# EAGLE design RR_PDB (EAGLE 9.6.2)
Power distribution board for the Reading Robot
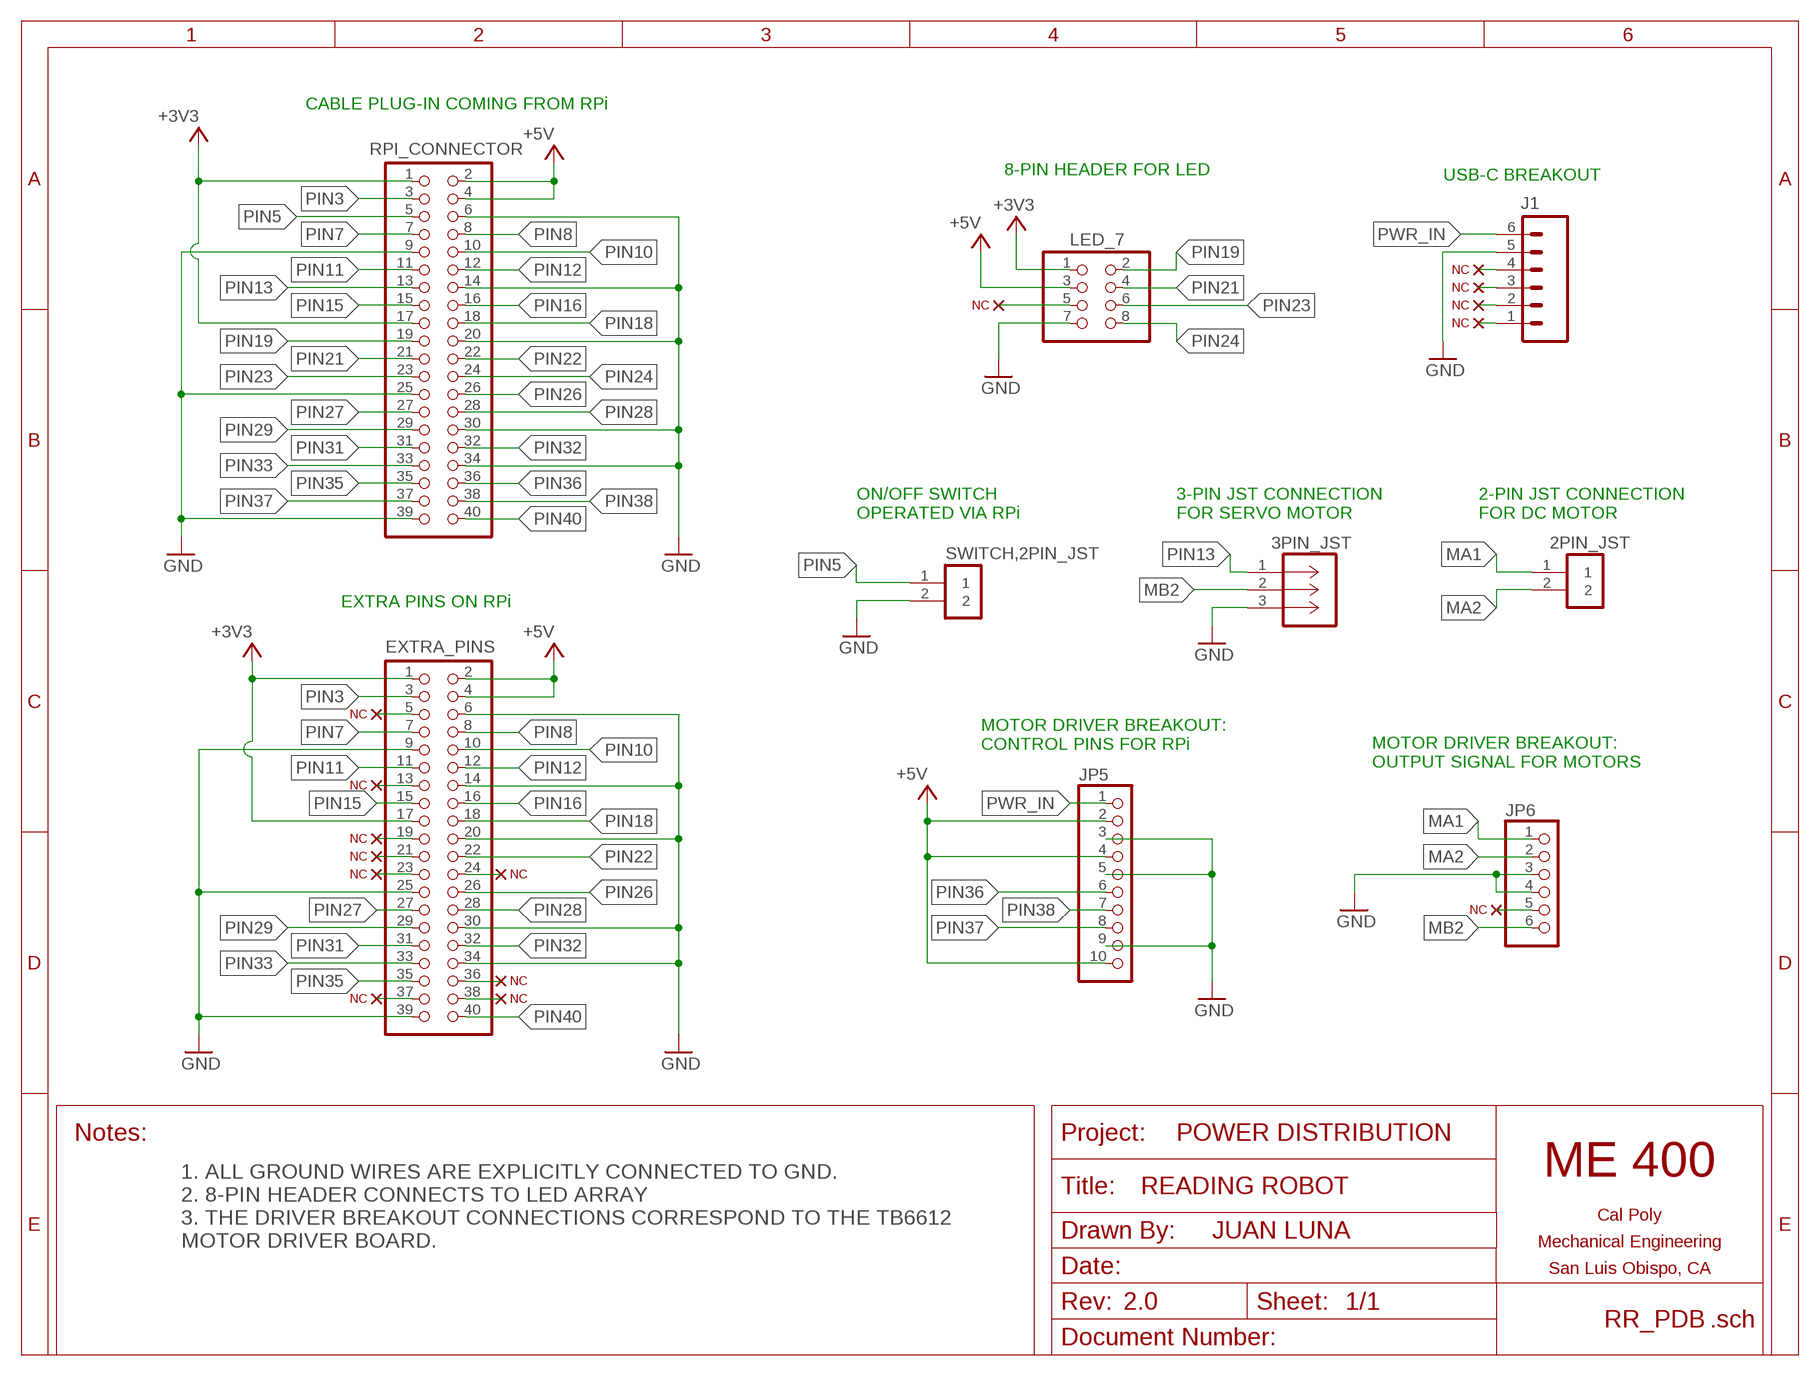
[diagram p0: schematic, sheet 1]
FRAME1 (TITLEBLOCK_LET_L): AUTHOR: JUAN LUNA; BOARD_NAME: READING ROBOT; COURSE: ME 400; DOC_NUM: 1; PROJECT_NAME: POWER DISTRIBUTION; REVISION: 2.0

## Parts
2PIN_JST  B2B-PH-K-S(LF)(SN)  [JST_B2B-PH-K-S(LF)(SN)]
3PIN_JST  B3B-PH-K-S(LF)(SN)  [CONN_B3B-PH-K-S(LF)(SN)_JST]
EXTRA_PINS  PINHD-2X20  [2X20]
J1  CONN_06NO_SILK_NO_POP  [1X06_NO_SILK]
JP5  HEADER-1X10THICKER  [1X10_ROUND_76]
JP6  PINHD-1X6CB  [1X06-CLEANBIG]
LED_7  PINHD-2X4  [2X04]
RPI_CONNECTOR  PINHD-2X20  [2X20]
SWITCH,2PIN_JST  B2B-PH-K-S(LF)(SN)  [JST_B2B-PH-K-S(LF)(SN)]
U$1  NC  (no package)
U$2  NC  (no package)
U$3  NC  (no package)
U$4  NC  (no package)
U$5  NC  (no package)
U$6  NC  (no package)
U$7  NC  (no package)
U$8  NC  (no package)
U$12  NC  (no package)
U$20  NC  (no package)
U$21  NC  (no package)
U$25  NC  (no package)
U$30  NC  (no package)
U$32  NC  (no package)
U$51  NC  (no package)

## Nets
+3V3: EXTRA_PINS.1 EXTRA_PINS.17 LED_7.1 RPI_CONNECTOR.1 RPI_CONNECTOR.17
+5V: EXTRA_PINS.2 EXTRA_PINS.4 JP5.2 JP5.4 JP5.10 LED_7.3 RPI_CONNECTOR.2 RPI_CONNECTOR.4
CC1: J1.4 U$5.D
CC2: J1.1 U$2.D
D+: J1.2 U$3.D
D-: J1.3 U$4.D
GND: 3PIN_JST.3 EXTRA_PINS.6 EXTRA_PINS.9 EXTRA_PINS.14 EXTRA_PINS.20 EXTRA_PINS.25 EXTRA_PINS.30 EXTRA_PINS.34 EXTRA_PINS.39 J1.5 JP5.3 JP5.5 JP5.9 JP6.3 JP6.4 LED_7.7 RPI_CONNECTOR.6 RPI_CONNECTOR.9 RPI_CONNECTOR.14 RPI_CONNECTOR.20 RPI_CONNECTOR.25 RPI_CONNECTOR.30 RPI_CONNECTOR.34 RPI_CONNECTOR.39 SWITCH,2PIN_JST.2
MA1: 2PIN_JST.1 JP6.1
MA2: 2PIN_JST.2 JP6.2
MB2: 3PIN_JST.2 JP6.6
N$1: LED_7.5 U$12.D
N$2: EXTRA_PINS.19 U$20.D
N$5: EXTRA_PINS.37 U$6.D
N$6: EXTRA_PINS.36 U$7.D
N$7: EXTRA_PINS.5 U$30.D
N$8: EXTRA_PINS.38 U$8.D
N$9: JP6.5 U$1.D
N$12: EXTRA_PINS.21 U$21.D
N$13: EXTRA_PINS.23 U$25.D
N$14: EXTRA_PINS.24 U$32.D
N$50: EXTRA_PINS.13 U$51.D
PIN3: EXTRA_PINS.3 RPI_CONNECTOR.3
PIN5: RPI_CONNECTOR.5 SWITCH,2PIN_JST.1
PIN7: EXTRA_PINS.7 RPI_CONNECTOR.7
PIN8: EXTRA_PINS.8 RPI_CONNECTOR.8
PIN10: EXTRA_PINS.10 RPI_CONNECTOR.10
PIN11: EXTRA_PINS.11 RPI_CONNECTOR.11
PIN12: EXTRA_PINS.12 RPI_CONNECTOR.12
PIN13: 3PIN_JST.1 RPI_CONNECTOR.13
PIN15: EXTRA_PINS.15 RPI_CONNECTOR.15
PIN16: EXTRA_PINS.16 RPI_CONNECTOR.16
PIN18: EXTRA_PINS.18 RPI_CONNECTOR.18
PIN19: LED_7.2 RPI_CONNECTOR.19
PIN21: LED_7.4 RPI_CONNECTOR.21
PIN22: EXTRA_PINS.22 RPI_CONNECTOR.22
PIN23: LED_7.6 RPI_CONNECTOR.23
PIN24: LED_7.8 RPI_CONNECTOR.24
PIN26: EXTRA_PINS.26 RPI_CONNECTOR.26
PIN27: EXTRA_PINS.27 RPI_CONNECTOR.27
PIN28: EXTRA_PINS.28 RPI_CONNECTOR.28
PIN29: EXTRA_PINS.29 RPI_CONNECTOR.29
PIN31: EXTRA_PINS.31 RPI_CONNECTOR.31
PIN32: EXTRA_PINS.32 RPI_CONNECTOR.32
PIN33: EXTRA_PINS.33 RPI_CONNECTOR.33
PIN35: EXTRA_PINS.35 RPI_CONNECTOR.35
PIN36: JP5.6 RPI_CONNECTOR.36
PIN37: JP5.8 RPI_CONNECTOR.37
PIN38: JP5.7 RPI_CONNECTOR.38
PIN40: EXTRA_PINS.40 RPI_CONNECTOR.40
PWR_IN: J1.6 JP5.1

## Notes on the sheet
- CABLE PLUG-IN COMING FROM RPi
- 8-PIN HEADER FOR LED
- USB-C BREAKOUT
- ON/OFF SWITCH
  OPERATED VIA RPi
- 3-PIN JST CONNECTION
  FOR SERVO MOTOR
- 2-PIN JST CONNECTION
  FOR DC MOTOR
- EXTRA PINS ON RPi
- MOTOR DRIVER BREAKOUT:
  CONTROL PINS FOR RPi
- MOTOR DRIVER BREAKOUT:
  OUTPUT SIGNAL FOR MOTORS
- 1. ALL GROUND WIRES ARE EXPLICITLY CONNECTED TO GND.
  2. 8-PIN HEADER CONNECTS TO LED ARRAY
  3. THE DRIVER BREAKOUT CONNECTIONS CORRESPOND TO THE TB6612
  MOTOR DRIVER BOARD.

## Library data of the parts
2PIN_JST SWITCH,2PIN_JST = CONN_HEADER_B2B-PH-K-S_LF__SN_:B2B-PH-K-S(LF)(SN): PH Series 2 Position 2 mm Pitch Through Hole Top Entry Shrouded Header; DESCRIPTION: Connector Header Through Hole 2 position 0.079 _2.00mm_; DIGI-KEY_PART_NUMBER: 455-1704-ND; DIGI-KEY_PURCHASE_URL: https://www.digikey.com/product-detail/en/jst-sales-america-inc/B2B-PH-K-S_LF__SN_/455-1704-ND/926611?utm_source=snapeda&utm_medium=aggregator&utm_campaign=symbol; MF: JST Sales; MP: B2B-PH-K-S_LF__SN_; PACKAGE: None
3PIN_JST = CONN_HEADER_B3B-PH-K-S_LF__SN_:B3B-PH-K-S(LF)(SN); COPYRIGHT: Copyright (C) 2023 Ultra Librarian. All rights reserved.; DIGIKEY_PART_NUMBER_1: 455-1705-ND; MANUFACTURER_PART_NUMBER: B3B-PH-K-S(LF)(SN); MFR_NAME: JST
EXTRA_PINS RPI_CONNECTOR = pinhead:PINHD-2X20: PIN HEADER
J1 = SparkFun-Connectors:CONN_06: Multi connection point. Often used as Generic Header-pin footprint for 0.1 inch spaced/style header connections On any of the 0.1 inch spaced packages, you can populate with these: Break Away Headers - Straight <https://www.sparkfun.com/products/116> (PRT-00116) Break Away Male Headers - Right Angle <https://www.sparkfun.com/products/553> (PRT-00553) Female Headers <https://www.sparkfun.com/products/115> (PRT-00115) Break Away Headers - Machine Pin <https://www.sparkfun.com/products/117> (PRT-00117) Break Away Female Headers - Swiss Machine Pin <https://www.sparkfun.com/products/743> (PRT-00743) Arduino Stackable Header - 6 Pin <https://www.sparkfun.com/products/9280> (PRT-09280) For SCREWTERMINALS and SPRING TERMINALS visit here: Screw Terimnals on SparkFun.com <https://www.sparkfun.com/search/results?term=Screw+Terminals> (5mm/3.5mm/2.54mm spacing) This device is also useful as a general connection point to wire up your design to another part of your project. Our various solder wires solder well into these plated through hole pads. Hook-Up Wire - Assortment (Stranded, 22 AWG) <https://www.sparkfun.com/products/11375> (PRT-11375) Hook-Up Wire - Assortment (Solid Core, 22 AWG) <https://www.sparkfun.com/products/11367> (PRT-11367) View the entire wire category on our website here <https://www.sparkfun.com/categories/141>
JP5 = microbuilder:HEADER-1X10: PIN HEADER
JP6 = adafruit:PINHD-1X6: PIN HEADER
LED_7 = pinhead:PINHD-2X4: PIN HEADER
U$1-U$8 U$12 U$20 U$21 U$25 U$30 U$32 U$51 = ME507:NC

## Net classes
1 power: width 0.178 mm

## Board
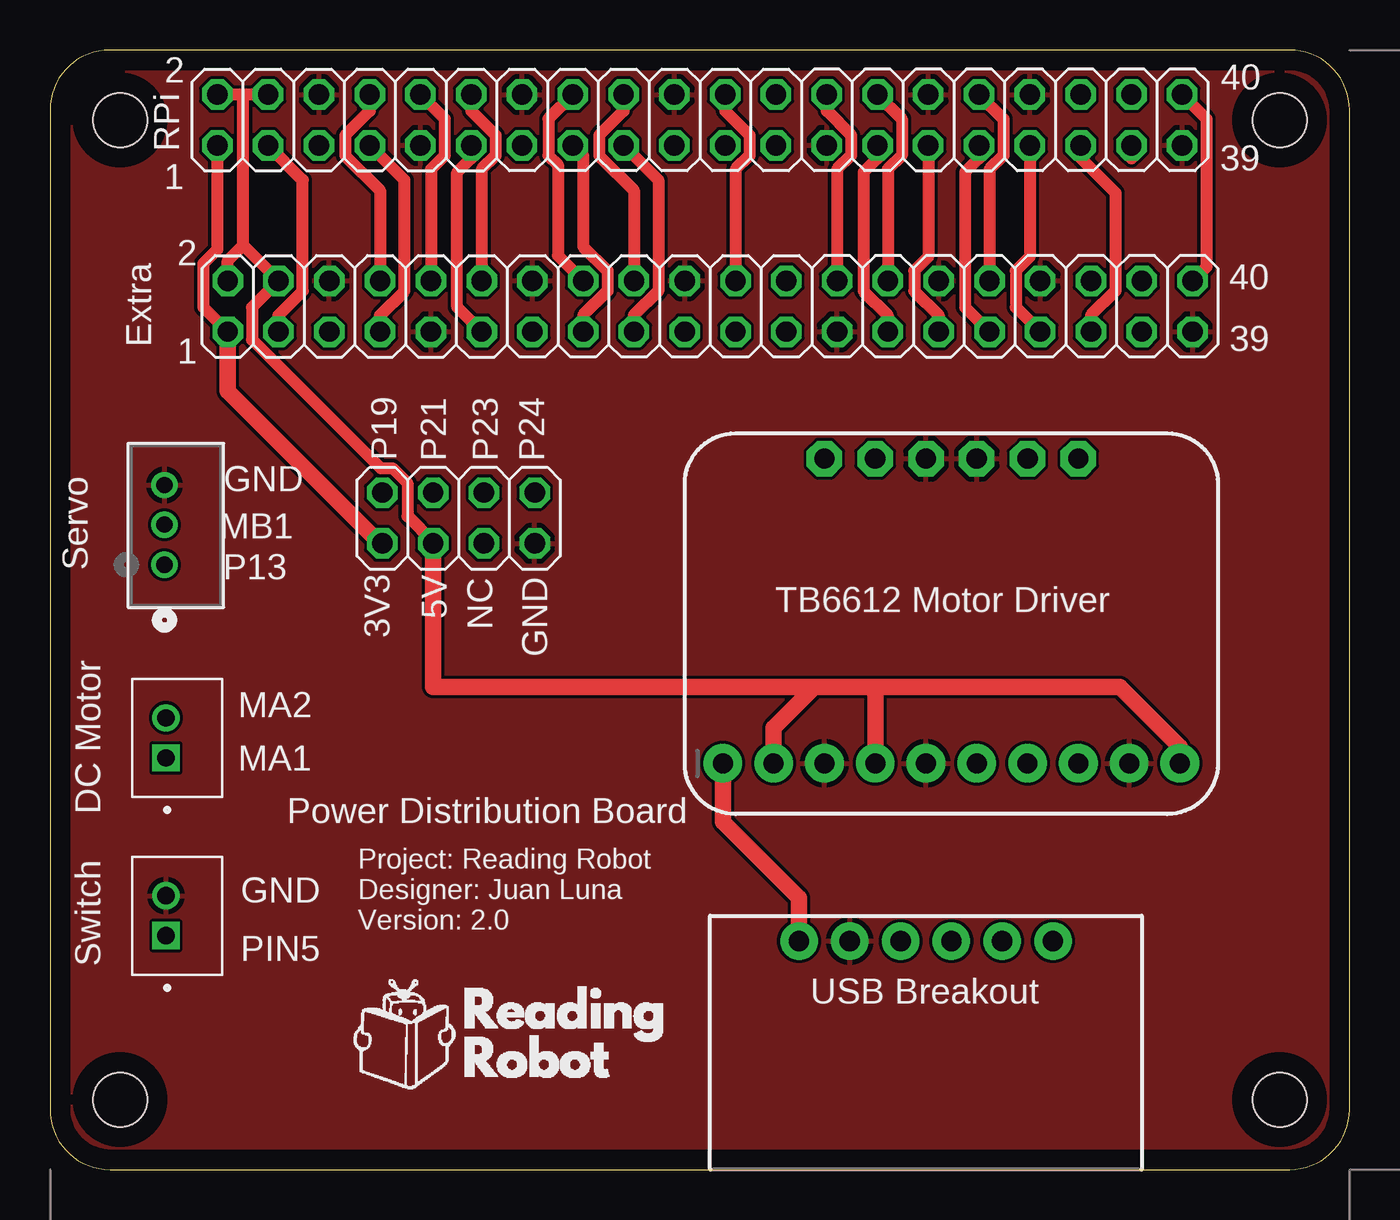
[diagram p1: board, top side]
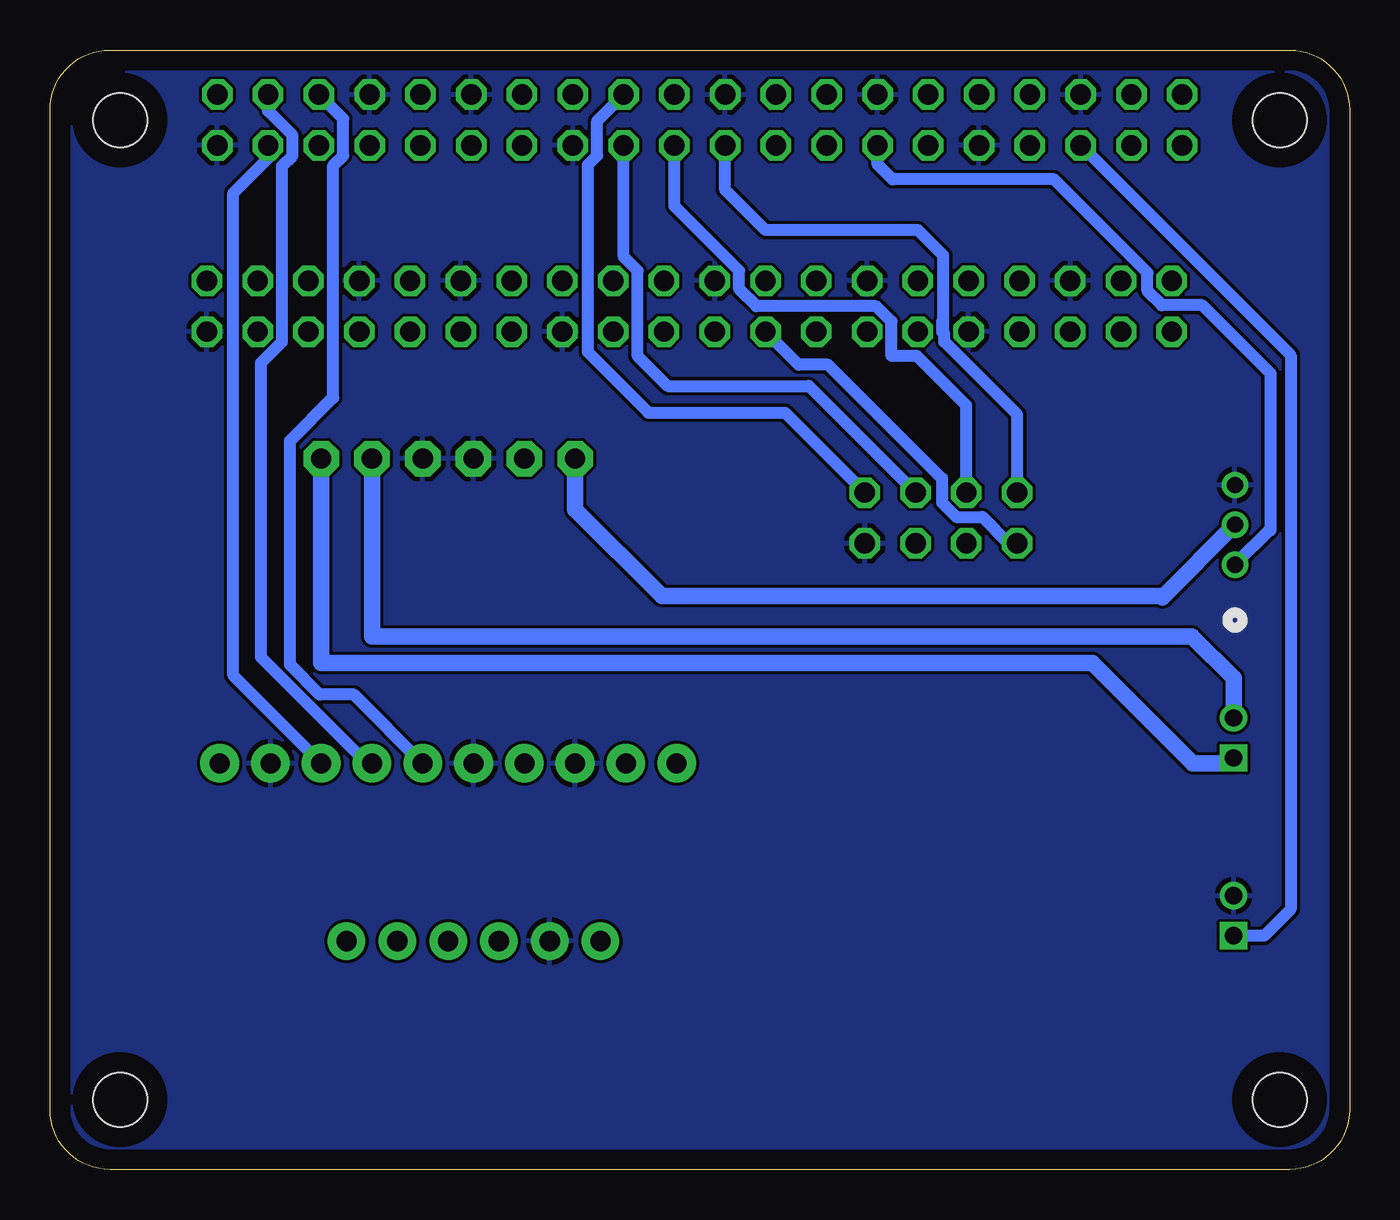
[diagram p2: board, bottom side, seen from below]

Size 65 x 56 mm. Coordinates in mm from the lower left corner, seen from the top.
Outline: 62,56 3,56 arc90 0,53 0,3 arc90 3,0 62,0 arc90 65,3 65,53 arc90 62,56
Copper layers (1*16): Top 0.035mm / dielectric 1.5mm / Bottom 0.035mm
Design rules "default": minimum track width 6mil, minimum drill 0.35mm, track to track 6mil, track to pad 6mil, pad to pad 6mil, via to via 6mil, smd to smd 6mil, copper to edge 40mil, drill to drill 6mil, minimum pad ring 10mil, minimum via ring 8mil, stop-mask expansion 4mil, vias tented up to drill 0mil, thermal gap 10mil
Holes 2.7 mm at 3.5,52.5 3.5,3.5 61.5,3.5 61.5,52.5

### Footprints (pad centres in the part's own frame; a part is rotated, then mirrored left to right if it is on the bottom)
JST_B2B-PH-K-S(LF)(SN) = drill 0.86 square: 1 1,-0.55 | drill 0.86: 2 -1,-0.55
CONN_B3B-PH-K-S(LF)(SN)_JST = drill 0.813 pad 1.321: 1 0,0; 2 -2.007,0; 3 -3.988,0
2X20 = drill 1.016 octagon: 1 -24.13,-1.27; 2 -24.13,1.27; 3 -21.59,-1.27; 4 -21.59,1.27; 5 -19.05,-1.27; 6 -19.05,1.27; 7 -16.51,-1.27; 8 -16.51,1.27; 9 -13.97,-1.27; 10 -13.97,1.27; 11 -11.43,-1.27; 12 -11.43,1.27; 13 -8.89,-1.27; 14 -8.89,1.27; 15 -6.35,-1.27; 16 -6.35,1.27; 17 -3.81,-1.27; 18 -3.81,1.27; 19 -1.27,-1.27; 20 -1.27,1.27; 21 1.27,-1.27; 22 1.27,1.27; 23 3.81,-1.27; 24 3.81,1.27; 25 6.35,-1.27; 26 6.35,1.27; 27 8.89,-1.27; 28 8.89,1.27; 29 11.43,-1.27; 30 11.43,1.27; 31 13.97,-1.27; 32 13.97,1.27; 33 16.51,-1.27; 34 16.51,1.27; 35 19.05,-1.27; 36 19.05,1.27; 37 21.59,-1.27; 38 21.59,1.27; 39 24.13,-1.27; 40 24.13,1.27
1X06_NO_SILK = drill 1.016 pad 1.88: 1 0,0; 2 2.54,0; 3 5.08,0; 4 7.62,0; 5 10.16,0; 6 12.7,0
1X10_ROUND_76 = drill 1 pad 1.93: 1 -11.43,0; 2 -8.89,0; 3 -6.35,0; 4 -3.81,0; 5 -1.27,0; 6 1.27,0; 7 3.81,0; 8 6.35,0; 9 8.89,0; 10 11.43,0
1X06-CLEANBIG = drill 1.016 pad 1.778 octagon: 1 -6.35,0; 2 -3.81,0; 3 -1.27,0; 4 1.27,0; 5 3.81,0; 6 6.35,0
2X04 = drill 1.016 octagon: 1 -3.81,-1.27; 2 -3.81,1.27; 3 -1.27,-1.27; 4 -1.27,1.27; 5 1.27,-1.27; 6 1.27,1.27; 7 3.81,-1.27; 8 3.81,1.27

### Placement (x,y rotation side)
2PIN_JST  6.35,21.59 270 top
3PIN_JST  5.73,30.25 270 top
EXTRA_PINS  33.02,43.18 0 top
J1  50.16,11.43 180 top
JP5  45.09,20.32 0 top
JP6  45.09,35.56 180 top
LED_7  20.43,32.59 0 top
RPI_CONNECTOR  32.5,52.5 0 top
SWITCH,2PIN_JST  6.35,12.7 270 top

### Tracks (layer width: path | path; a pad name or v marks a point on that pad's centre or on a via)
+3V3
  Top 0.61: RPI_CONNECTOR.1 8.37,46.02 7.67,45.32 7.67,43.13 EXTRA_PINS.1 | EXTRA_PINS.17 29.21,42.73 30.43,43.95 30.43,49.49 RPI_CONNECTOR.17
  Top 0.813: EXTRA_PINS.1 8.89,38.94 16.51,31.32 LED_7.1
  Bottom 0.61: EXTRA_PINS.17 27.56,40.26 26.08,40.26 20.38,34.57 20.38,33.35 19.67,32.64 18.37,32.64 17.05,31.32 LED_7.1
+5V
  Top 0.61: RPI_CONNECTOR.4 9.78,53.77 | 9.78,53.77 RPI_CONNECTOR.2 | 9.65,46.23 EXTRA_PINS.4 10.11,43.13 10.11,41.51 16.54,35.08 17.13,35.08 17.88,34.33 17.88,32.68 19.16,31.39 | 9.78,53.77 9.65,53.64 9.65,46.23 | EXTRA_PINS.2 8.89,45.47 9.65,46.23
  Top 0.813: JP5.10 56.52,21.13 53.52,24.13 41.27,24.13 | JP5.4 41.27,24.13 | JP5.2 36.2,22.08 38.24,24.13 | 41.27,24.13 38.24,24.13 | 38.24,24.13 19.16,24.13 LED_7.3 19.16,31.39
GND
  pour Top: -3.89,58.42 -3.89,-3.81 76.2,-3.81 76.2,58.42
  pour Bottom: -6.35,60.46 -6.35,-6.35 78.74,-6.35 78.74,60.46
MA1
  Bottom 0.813: JP6.1 51.44,25.34 12.85,25.34 7.84,20.32 5.8,20.32 2PIN_JST.1
MA2
  Bottom 0.813: 2PIN_JST.2 5.8,24.58 7.89,26.67 48.9,26.67 JP6.2
MB2
  Bottom 0.813: 3PIN_JST.2 9.37,28.62 9.48,28.68 34.39,28.68 38.73,33.02 JP6.6
PIN3
  Top 0.61: EXTRA_PINS.3 11.43,42.73 12.65,43.95 12.65,49.49 RPI_CONNECTOR.3
PIN5
  Bottom 0.61: RPI_CONNECTOR.5 2.95,40.73 2.95,13.02 4.26,11.7 SWITCH,2PIN_JST.1
PIN7
  Top 0.61: EXTRA_PINS.7 16.51,42.73 17.73,43.95 17.73,49.49 RPI_CONNECTOR.7
PIN8
  Top 0.61: RPI_CONNECTOR.8 15.99,52.95 14.77,51.73 14.77,50.73 16.51,48.99 EXTRA_PINS.8
PIN10
  Top 0.61: EXTRA_PINS.10 19.05,50.03 19.75,50.73 19.75,52.55 RPI_CONNECTOR.10
PIN11
  Top 0.61: RPI_CONNECTOR.11 21.07,50.58 20.37,49.88 20.37,43.13 EXTRA_PINS.11
PIN12
  Top 0.61: RPI_CONNECTOR.12 21.07,52.95 22.29,51.73 22.29,50.73 21.59,50.03 EXTRA_PINS.12
PIN13
  Bottom 0.61: RPI_CONNECTOR.13 23.61,50.28 22.86,49.53 14.79,49.53 10.11,44.85 10.11,43.95 9.39,43.23 7.37,43.23 3.96,39.83 3.96,31.98 3.97,32.01 3PIN_JST.1
PIN15
  Top 0.61: RPI_CONNECTOR.15 26.67,50.71 26.67,46.17 27.89,44.95 27.89,43.95 26.67,42.73 EXTRA_PINS.15
PIN16
  Top 0.61: RPI_CONNECTOR.16 24.93,52.55 24.93,50.73 25.4,50.26 25.4,45.72 EXTRA_PINS.16
PIN18
  Top 0.61: RPI_CONNECTOR.18 28.69,52.95 27.47,51.73 27.47,50.73 29.21,48.99 EXTRA_PINS.18
PIN19
  Bottom 0.61: 20.37,41.91 20.37,42.41 | 20.37,41.91 20.32,41.96 20.32,45.72 21.59,46.99 29.21,46.99 31.23,49.01 RPI_CONNECTOR.19 | 20.37,41.91 20.27,41.81 20.27,41.41 16.62,37.76 LED_7.2
PIN21
  Bottom 0.61: RPI_CONNECTOR.21 33.77,48.19 30.53,44.95 30.53,44.05 29.66,43.18 23.68,43.18 22.91,42.41 22.91,40.69 21.64,40.69 19.16,38.21 LED_7.4
PIN22
  Top 0.61: RPI_CONNECTOR.22 33.77,52.95 34.99,51.73 34.99,50.73 34.29,50.03 EXTRA_PINS.22
PIN23
  Bottom 0.61: LED_7.6 27.04,39.19 34.11,39.19 35.61,40.69 35.61,44.95 36.31,45.65 RPI_CONNECTOR.23
PIN24
  Bottom 0.61: LED_7.8 28.25,37.86 35.06,37.86 38.1,40.89 38.1,50.26 37.63,50.73 37.63,52.45 RPI_CONNECTOR.24
PIN26
  Top 0.61: RPI_CONNECTOR.26 38.85,52.95 40.07,51.73 40.07,50.73 39.37,50.03 EXTRA_PINS.26
PIN27
  Top 0.61: RPI_CONNECTOR.27 41.39,50.58 40.69,49.88 40.69,43.95 41.91,42.73 EXTRA_PINS.27
PIN28
  Top 0.61: EXTRA_PINS.28 41.91,50.03 42.61,50.73 42.61,52.55 RPI_CONNECTOR.28
PIN29
  Top 0.61: EXTRA_PINS.29 44.45,42.73 43.23,43.95 43.23,44.95 43.93,45.65 RPI_CONNECTOR.29
PIN31
  Top 0.61: RPI_CONNECTOR.31 46.47,50.58 45.77,49.88 45.77,43.13 EXTRA_PINS.31
PIN32
  Top 0.61: EXTRA_PINS.32 46.99,50.03 47.69,50.73 47.69,52.55 RPI_CONNECTOR.32
PIN33
  Top 0.61: RPI_CONNECTOR.33 49.01,45.65 48.31,44.95 48.31,43.13 EXTRA_PINS.33
PIN35
  Top 0.61: EXTRA_PINS.35 52.07,42.73 53.29,43.95 53.29,48.86 51.55,50.59 RPI_CONNECTOR.35
PIN36
  Bottom 0.61: JP5.6 49.8,23.76 51.51,23.76 53,25.25 53,36.44 50.83,38.61 50.83,50.23 50.33,50.73 50.33,52.55 RPI_CONNECTOR.36
PIN37
  Top 0.61: RPI_CONNECTOR.37 54.09,50.58
  Bottom 0.61: RPI_CONNECTOR.37 54.09,50.58 55.83,48.84 55.83,24.71 JP5.8
PIN38
  Bottom 0.61: JP5.7 49.14,20.32 54.45,25.62 54.45,40.35 53.39,41.41 53.39,50.2 52.87,50.73 52.87,51.73 54.09,52.95 RPI_CONNECTOR.38
PIN40
  Top 0.61: EXTRA_PINS.40 57.85,45.15 57.85,52.55 RPI_CONNECTOR.40
PWR_IN
  Top 0.813: JP5.1 33.66,17.39 37.47,13.58 J1.6

### Text on the board
tPlace: 2 | 40 | RPi | 39 | 1 | 2 | 40 | Extra | 39 | 1 | P19 | P21 | P23 | P24 | GND | MB1 | Servo | P13 | 3V3 | 5V | NC | GND | TB6612 Motor Driver | MA2 | MA1 | DC Motor | Power Distribution Board | GND | Project: Reading Robot / Designer: Juan Luna / Version: 2.0 | Switch | PIN5 | USB Breakout